# Altium schematic sheet xxxxxx.001_sh1_RTC.SchDoc
size 419 x 297 mm; DocumentNumber: XXXX.467119.XXX Э3; SheetNumber: 1; SheetTotal: 3; Title1str: Плата распределения; Title2str: тактовых частот; PageSetup: Record=PageOptions|CenterHorizontal=False|CenterVertical=False|PrintScale=1.00|XCorrection=0.00|YCorrection=0.00|PrintKind=1|BorderSize=5000000|LeftOffset=0|BottomOffset=0|Orientation=2|PaperLength=1000|PaperWidth=1000|Scale=100|PaperSource=7|PrintQuality=-4|MediaType=1|DitherType=10|PrintScaleMode=0|PaperKind=A3|PaperIndex=8; TypeOfSchem: Схема электрическая принципиальная; DocumentNumberE3: XXXX.467119.XXX Э3; DocumentName: Sheet1.SCHDOC
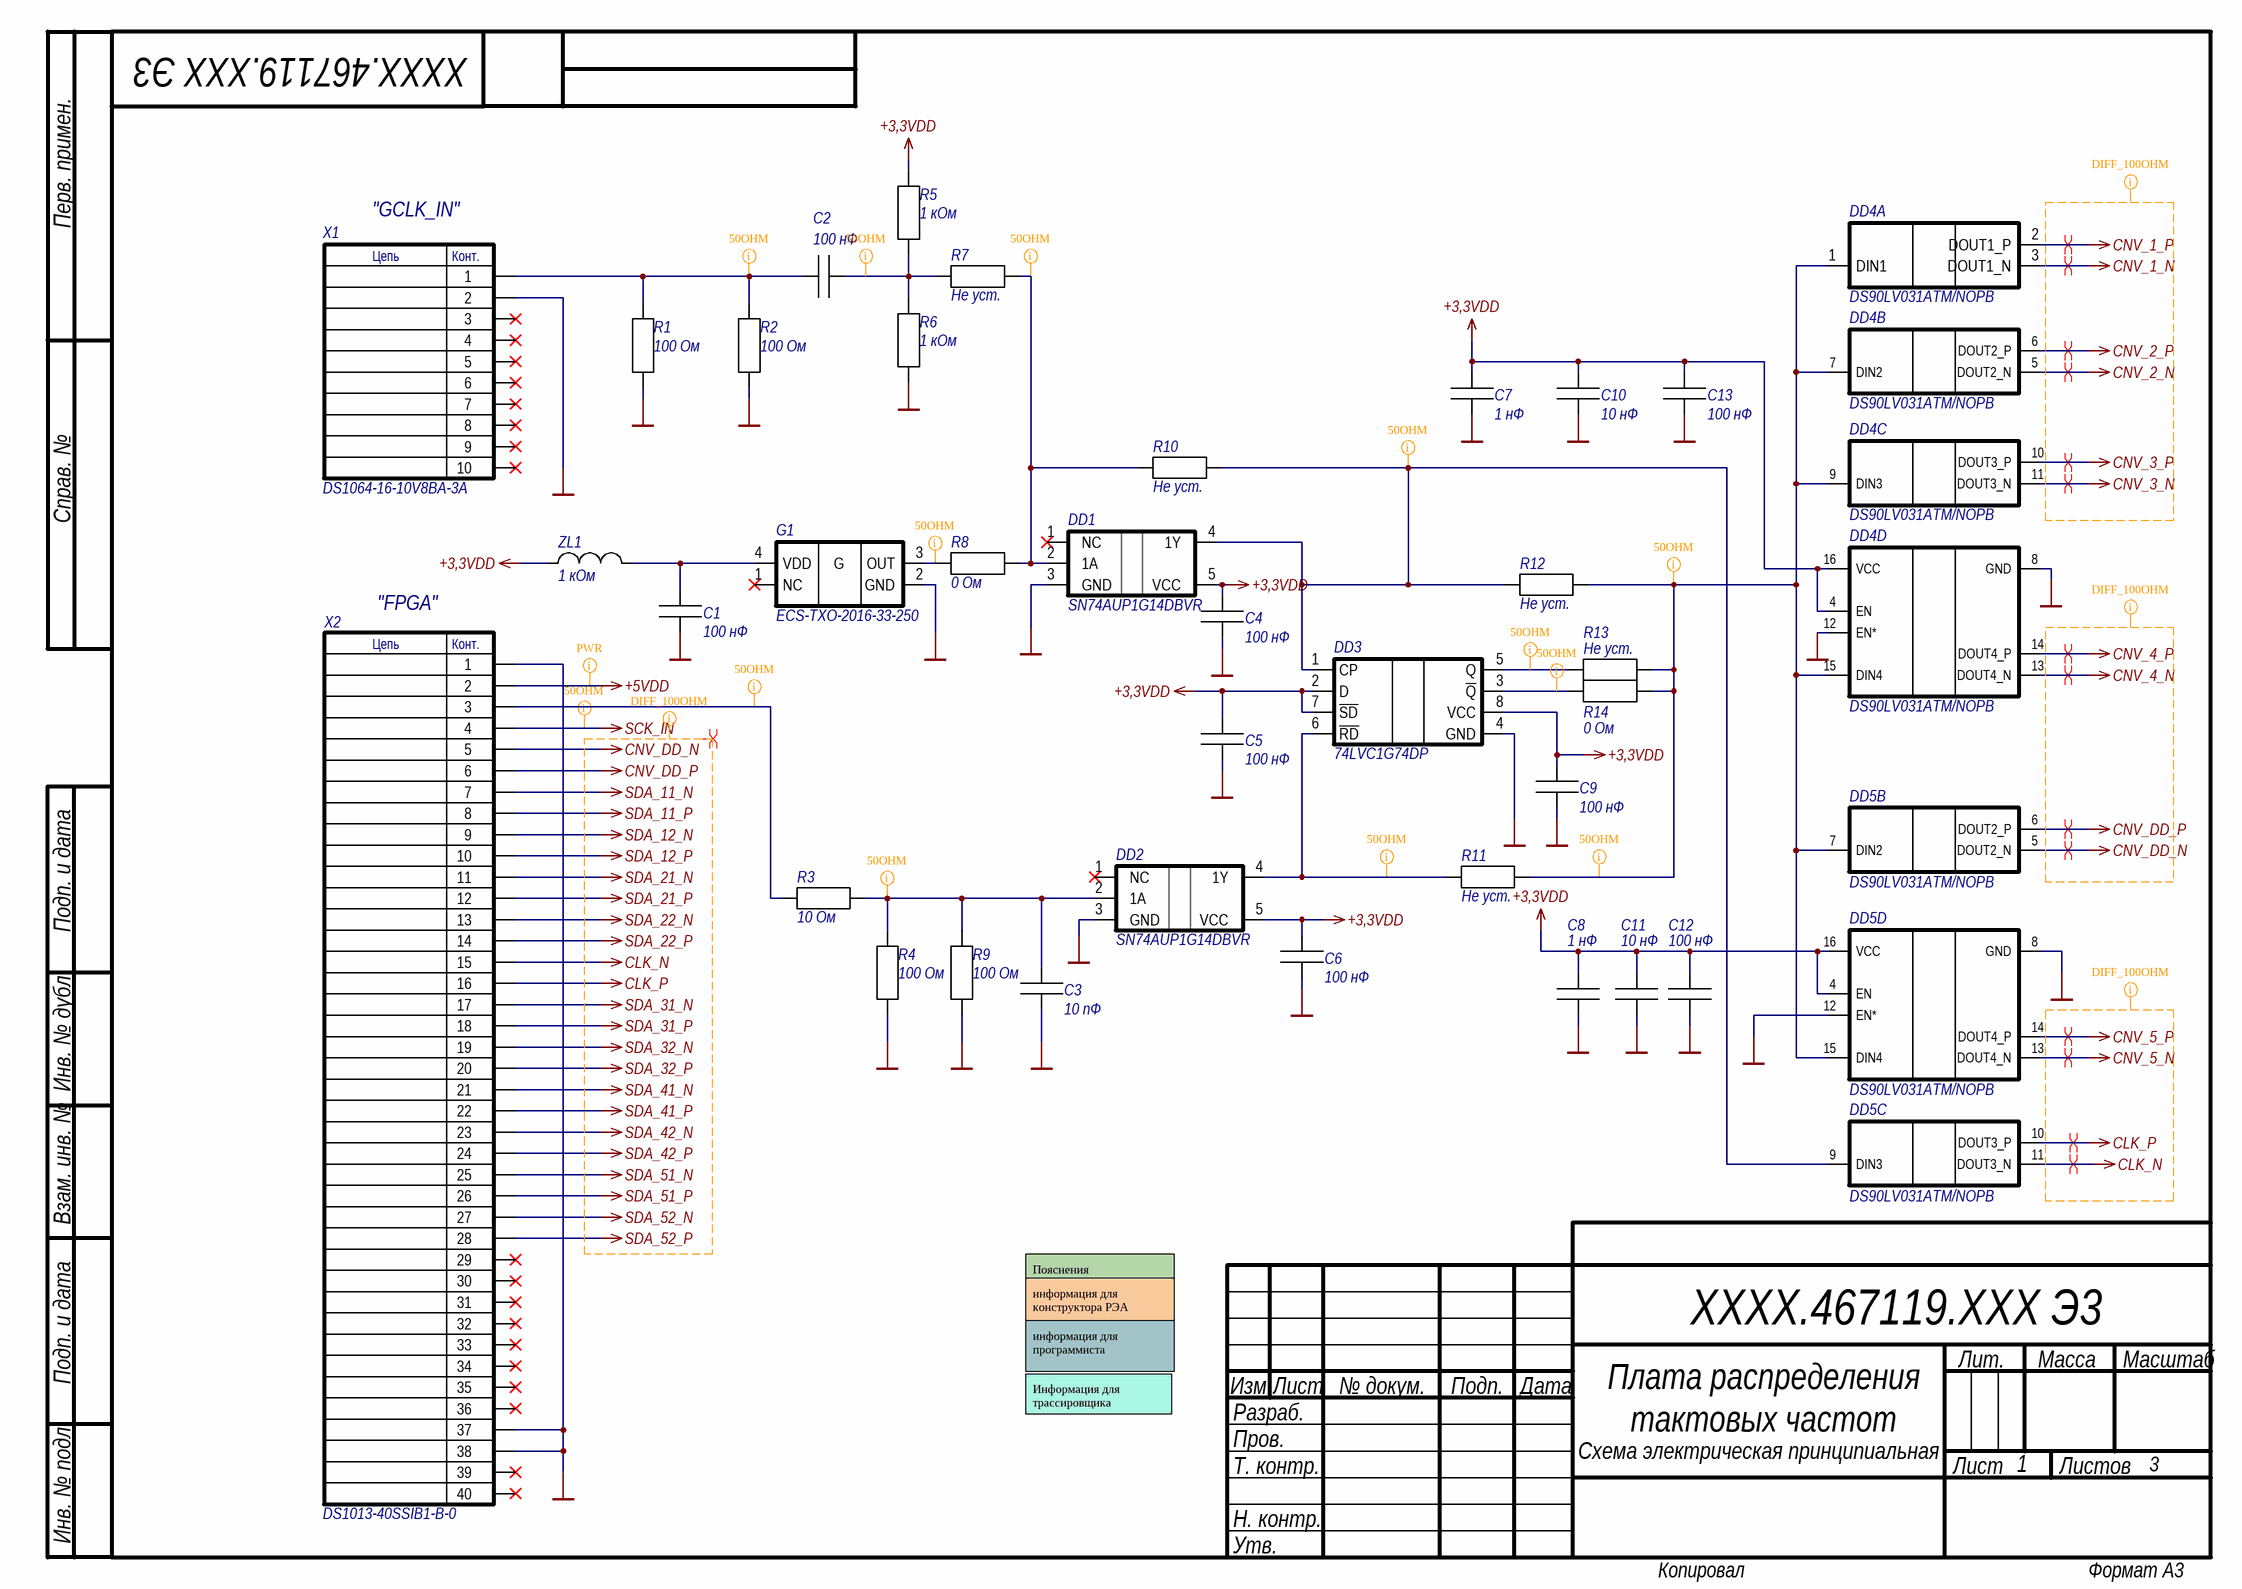
[diagram p0: xxxxxx.001_sh1_RTC.SchDoc]

## Parts
C1  100 нФ  [CAPC160X080X080N]
C2  100 нФ  [CAPC160X080X080N]
C3  10 пФ  [CAPC160X080X080N]
C4  100 нФ  [CAPC160X080X080N]
C5  100 нФ  [CAPC160X080X080N]
C6  100 нФ  [CAPC160X080X080N]
C7  1 нФ  [CAPC160X080X080N]
C8  1 нФ  [CAPC160X080X080N]
C9  100 нФ  [CAPC160X080X080N]
C10  10 нФ  [CAPC160X080X080N]
C11  10 нФ  [CAPC160X080X080N]
C12  100 нФ  [CAPC160X080X080N]
C13  100 нФ  [CAPC160X080X080N]
DD1  SN74AUP1G14DBVR  [TI_DBV0005A_SOT23_5]
DD2  SN74AUP1G14DBVR  [TI_DBV0005A_SOT23_5]
DD3  74LVC1G74DP  [TSOP65P400X110-8N]
DD4  DS90LV031ATM/NOPB  [SOIC127P600X175-16N]  (parts A,B,C,D of 4)
DD5  DS90LV031ATM/NOPB  [SOIC127P600X175-16N]  (parts B,C,D of 4)
G1  ECS-TXO-2016-33-250  [OSCCC160X200X80-4N]
R1  100 Ом  [RESC160X080X045N]
R2  100 Ом  [RESC160X080X045N]
R3  10 Ом  [RESC160X080X045N]
R4  100 Ом  [RESC160X080X045N]
R5  1 кОм  [RESC160X080X045N]
R6  1 кОм  [RESC160X080X045N]
R7  Не уст.  [RESC160X080X045N]
R8  0 Ом  [RESC160X080X045N]
R9  100 Ом  [RESC160X080X045N]
R10  Не уст.  [RESC160X080X045N]
R11  Не уст.  [RESC160X080X045N]
R12  Не уст.  [RESC160X080X045N]
R13  Не уст.  [RESC160X080X045N]
R14  0 Ом  [RESC160X080X045N]
X1  DS1064-16-10V8BA-3A  [BHTH127x254_2X5]
X2  DS1013-40SSIB1-B-0  [BHTH254_2X20]
ZL1  1 кОм  [INDC100X050X050N]

## Nets
+3,3VDD: C4.1 C5.1 C6.1 C7.1 C8.1 C9.1 C10.1 C11.1 C12.1 C13.1 DD1.5(VCC) DD2.5(VCC) DD3.2(D) DD3.7(~{SD}) DD3.8(VCC) DD4.4(EN) DD4.16(VCC) DD5.4(EN) DD5.16(VCC) R5.1 ZL1.1
+5VDD: X2.2
CLK_N: DD5.11(DOUT3_N) X2.15
CLK_P: DD5.10(DOUT3_P) X2.16
CNV_1_N: DD4.3(DOUT1_N)
CNV_1_P: DD4.2(DOUT1_P)
CNV_2_N: DD4.5(DOUT2_N)
CNV_2_P: DD4.6(DOUT2_P)
CNV_3_N: DD4.11(DOUT3_N)
CNV_3_P: DD4.10(DOUT3_P)
CNV_4_N: DD4.13(DOUT4_N)
CNV_4_P: DD4.14(DOUT4_P)
CNV_5_N: DD5.13(DOUT4_N)
CNV_5_P: DD5.14(DOUT4_P)
CNV_DD_N: DD5.5(DOUT2_N) X2.5
CNV_DD_P: DD5.6(DOUT2_P) X2.6
GND: C1.2 C3.2 C4.2 C5.2 C6.2 C7.2 C8.2 C9.2 C10.2 C11.2 C12.2 C13.2 DD1.3(GND) DD2.3(GND) DD3.4(GND) DD4.8(GND) DD4.12(EN*) DD5.8(GND) DD5.12(EN*) G1.2(GND) R1.2 R2.2 R4.2 R6.2 R9.2 X1.2 X2.1 X2.37 X2.38
SCK_IN: X2.4
SDA_11_N: X2.7
SDA_11_P: X2.8
SDA_12_N: X2.9
SDA_12_P: X2.10
SDA_21_N: X2.11
SDA_21_P: X2.12
SDA_22_N: X2.13
SDA_22_P: X2.14
SDA_31_N: X2.17
SDA_31_P: X2.18
SDA_32_N: X2.19
SDA_32_P: X2.20
SDA_41_N: X2.21
SDA_41_P: X2.22
SDA_42_N: X2.23
SDA_42_P: X2.24
SDA_51_N: X2.25
SDA_51_P: X2.26
SDA_52_N: X2.27
SDA_52_P: X2.28
NetC1_1: C1.1 G1.4(VDD) ZL1.2
NetC2_1: C2.1 R1.1 R2.1 X1.1
NetC2_2: C2.2 R5.2 R6.1 R7.1
NetC3_1: C3.1 DD2.2(1A) R3.2 R4.1 R9.1
NetDD1_2: DD1.2(1A) R7.2 R8.2 R10.1
NetDD1_4: DD1.4(1Y) DD3.1(CP) DD5.9(DIN3) R10.2 R12.1
NetDD2_4: DD2.4(1Y) DD3.6(~{RD}) R11.1
NetDD3_3: DD3.3(~{Q}) R14.1
NetDD3_5: DD3.5(Q) R13.1
NetDD4_1: DD4.1(DIN1) DD4.7(DIN2) DD4.9(DIN3) DD4.15(DIN4) DD5.7(DIN2) DD5.15(DIN4) R11.2 R12.2 R13.2 R14.2
NetG1_3: G1.3(OUT) R8.1
NetR3_1: R3.1 X2.3

Not connected (* = marked no-connect by the designer): DD1 1(NC)*; DD2 1(NC)*; G1 1(NC)*; X1 3* 4* 5* 6* 7* 8* 9* 10*; X2 29* 30* 31* 32* 33* 34* 35* 36* 39* 40*

## Layout directives
differential pair: CLK_N, CLK_P, CNV_1_N, CNV_1_P, CNV_2_N, CNV_2_P, CNV_3_N, CNV_3_P, CNV_4_N, CNV_4_P, CNV_5_N, CNV_5_P, CNV_DD_N, CNV_DD_P, SDA_11_N, SDA_11_P, SDA_12_N, SDA_12_P, SDA_21_N, SDA_21_P, SDA_22_N, SDA_22_P, SDA_31_N, SDA_31_P, SDA_32_N, SDA_32_P, SDA_41_N, SDA_41_P, SDA_42_N, SDA_42_P, SDA_51_N, SDA_51_P, SDA_52_N, SDA_52_P
net class DIFF_100OHM: CLK_N, CLK_P, CNV_1_N, CNV_1_P, CNV_2_N, CNV_2_P, CNV_3_N, CNV_3_P, CNV_4_N, CNV_4_P, CNV_5_N, CNV_5_P, CNV_DD_N, CNV_DD_P, SDA_11_N, SDA_11_P, SDA_12_N, SDA_12_P, SDA_21_N, SDA_21_P, SDA_22_N, SDA_22_P, SDA_31_N, SDA_31_P, SDA_32_N, SDA_32_P, SDA_41_N, SDA_41_P, SDA_42_N, SDA_42_P, SDA_51_N, SDA_51_P, SDA_52_N, SDA_52_P
net class 50OHM: NetC2_1, NetC2_2, NetC3_1, NetDD1_2, NetDD1_4, NetDD2_4, NetDD3_3, NetDD3_5, NetDD4_1, NetG1_3, NetR3_1, SCK_IN
net class PWR: +5VDD

## Notes on the sheet
- "GCLK_IN"
- "FPGA"
- Пояснения
- информация для конструктора РЭА
- информация для программиста
- Информация для трассировщика
- Перв. примен.
- Справ. №
- Подп. и дата
- Инв. № дубл.
- Взам. инв. №
- Лит.
- Масса
- Масштаб
- Изм.
- Разраб.
- Лист
- № докум.
- Подп.
- Дата
- Т. контр.
- Пров.
- Листов
- Инв. № подл.
- Утв.
- Н. контр.
- Копировал
- Формат A3
- (in symbol 16896) Цепь; Конт.
- (in symbol 16897) Цепь; Конт.
- (in symbol 16902) G

## Library data of the parts
C1 C2 C4-C6 C9 C12 C13 = 16734: Chip Monolithic Ceramic Capacitor; Manufacturer: Murata; Part Number: GRM188R71E104KA01D; Number: 16734; Type: Конденсатор; Ceramic Type: X7R; Voltage: 25 В; Tolerance: ±10%; ValueBOM: Chip Monolithic Ceramic Capacitor, 0603, X7R, 25V, ±10%, 100n; Package: 0603; Series: GRM188; ValueSCH: 100 нФ; ComponentLink1Description: Datasheet; ComponentLink1URL: ftp://51.15.50.217/murata/capacitors/chip_monolithic_ceramic_cap.pdf; Note: *; ManufacturerPartNumber: GRM188R71E104KA01D
C3 = 274: Multilayer Ceramic Chip Capacitor; Manufacturer: Yageo; Part Number: CC0603GPNP09BN100; Number: 274; Type: Конденсатор; Ceramic Type: NP0; Voltage: 50 В; Tolerance: ±2%; ValueBOM: Multilayer Ceramic Chip Capacitor, 0603, NP0, 50V, ±2%, 10p; Package: 0603; Series: CC0603; ValueSCH: 10 пФ; HelpURL: http://www.yageo.com/e; ComponentLink1Description: Datasheet; ComponentLink1URL: ftp://51.15.50.217/yageo/capasitors/CC_series_(NP0).pdf#; Modify Date: 25.03.2009; Note: *; ManufacturerPartNumber: CC0603GPNP09BN100
C7 C8 = 16711: Chip Monolithic Ceramic Capacitor; Manufacturer: Murata; Part Number: GRM188R71H102KA01D; Number: 16711; Type: Конденсатор; Ceramic Type: X7R; Voltage: 50 В; Tolerance: ±10%; ValueBOM: Chip Monolithic Ceramic Capacitor, 0603, X7R, 50V, ±10%, 1n; Package: 0603; Series: GRM188; ValueSCH: 1 нФ; ComponentLink1Description: Datasheet; ComponentLink1URL: ftp://51.15.50.217/murata/capacitors/chip_monolithic_ceramic_cap.pdf; Note: *; ManufacturerPartNumber: GRM188R71H102KA01D
C10 C11 = 16728: Chip Monolithic Ceramic Capacitor; Manufacturer: Murata; Part Number: GRM188R71E103KA01D; Number: 16728; Type: Конденсатор; Ceramic Type: X7R; Voltage: 25 В; Tolerance: ±10%; ValueBOM: Chip Monolithic Ceramic Capacitor, 0603, X7R, 25V, ±10%, 10n; Package: 0603; Series: GRM188; ValueSCH: 10 нФ; ComponentLink1Description: Datasheet; ComponentLink1URL: ftp://51.15.50.217/murata/capacitors/chip_monolithic_ceramic_cap.pdf; Note: *; ManufacturerPartNumber: GRM188R71E103KA01D
DD1 DD2 = 16900: Low-Power Single Schmitt-Trigger Inverter; Manufacturer: Texas Instruments; Number: 16900; Type: Микросхема цифровая; Part Number: SN74AUP1G14DBVR; ValueSCH: SN74AUP1G14DBVR; ValueBOM: Low-Power Single Schmitt-Trigger Inverter; Modify Date: 21.06.2023; Mount: 1; Package: 101; Note: *; ManufacturerPartNumber: SN74AUP1G14DBVR
DD3 = 16899: Single D-type flip-flop with set and reset; Manufacturer: Nexperia; Number: 16899; Type: Микросхема цифровая; Part Number: 74LVC1G74DP; ValueSCH: 74LVC1G74DP; ValueBOM: Single D-type flip-flop with set and reset; Modify Date: 21.06.2023; Mount: 1; Package: 135; Note: *; ManufacturerPartNumber: 74LVC1G74DP
DD4 DD5 = 16898: 3-V LVDS Quad CMOS Differential Line Driver; Manufacturer: Texas Instruments; Number: 16898; Type: Микросхема цифровая; Part Number: DS90LV031ATM/NOPB; ValueSCH: DS90LV031ATM/NOPB; ValueBOM: 3-V LVDS Quad CMOS Differential Line Driver; Modify Date: 21.06.2023; Note: *; ManufacturerPartNumber: DS90LV031ATM/NOPB
G1 = 16902: SMD CMOS TCXO, 25 МГц, ±2.5ppm; Manufacturer: ECS INC INTERNATIONAL; Number: 16902; ValueSCH: 25 МГц; Type: Генератор; Package: 68; Series: TXO-2016; Part Number: ECS-TXO-2016-33-250; ValueBOM: SMD CMOS TCXO, 25 МГц, ±2.5ppm; Modify Date: 21.06.2023; Mount: 1; Note1SCH: 25 МГц; Note2SCH: ±2.5ppm; Note: *; ManufacturerPartNumber: ECS-TXO-2016-33-250
R1 R2 R4 R9 = 2702: General Purpose Chip Resistor; Manufacturer: Yageo; Part Number: RC0603FR-13100R; Number: 2702; Power: 100 мВт; Tolerance: ±1%; ValueBOM: General Purpose Chip Resistor, 0603, ±1%, 100R; Type: Резистор; Package: 0603; Series: RC0603; ValueSCH: 100 Ом; HelpURL: http://www.yageo.com/e; ComponentLink1Description: Datasheet; ComponentLink1URL: ftp://51.15.50.217/yageo/resistors/RC0603_series.pdf#; Modify Date: 04.01.2009; Note: *; ManufacturerPartNumber: RC0603FR-13100R
R3 = 2588: General Purpose Chip Resistor; Manufacturer: Yageo; Part Number: RC0603FR-1310R; Number: 2588; Power: 100 мВт; Tolerance: ±1%; ValueBOM: General Purpose Chip Resistor, 0603, ±1%, 10R; Type: Резистор; Package: 0603; Series: RC0603; ValueSCH: 10 Ом; HelpURL: http://www.yageo.com/e; ComponentLink1Description: Datasheet; ComponentLink1URL: ftp://51.15.50.217/yageo/resistors/RC0603_series.pdf#; Modify Date: 04.01.2009; Note: *; ManufacturerPartNumber: RC0603FR-1310R
R5 R6 = 2816: General Purpose Chip Resistor; Manufacturer: Yageo; Part Number: RC0603FR-131K; Number: 2816; Power: 100 мВт; Tolerance: ±1%; ValueBOM: General Purpose Chip Resistor, 0603, ±1%, 1K; Type: Резистор; Package: 0603; Series: RC0603; ValueSCH: 1 кОм; HelpURL: http://www.yageo.com/e; ComponentLink1Description: Datasheet; ComponentLink1URL: ftp://51.15.50.217/yageo/resistors/RC0603_series.pdf#; Modify Date: 04.01.2009; Note: *; ManufacturerPartNumber: RC0603FR-131K
R7 R10-R13 = 2058: General Purpose Chip Resistor; Manufacturer: Yageo; Part Number: RC0603JR-130R; Number: 2058; Power: 100 мВт; Tolerance: ±5%; ValueSCH: 0 Ом; ValueBOM: General Purpose Chip Resistor, 0603, ±5%, 0R; Type: Резистор; Package: 0603; Series: RC0603; HelpURL: http://www.yageo.com/e; ComponentLink1Description: Datasheet; ComponentLink1URL: ftp://51.15.50.217/yageo/resistors/RC0603_series.pdf#; Modify Date: 04.01.2009; Note: Не уст.; ManufacturerPartNumber: RC0603JR-130R
R8 R14 = 2058: General Purpose Chip Resistor; Manufacturer: Yageo; Part Number: RC0603JR-130R; Number: 2058; Power: 100 мВт; Tolerance: ±5%; ValueBOM: General Purpose Chip Resistor, 0603, ±5%, 0R; Type: Резистор; Package: 0603; Series: RC0603; ValueSCH: 0 Ом; HelpURL: http://www.yageo.com/e; ComponentLink1Description: Datasheet; ComponentLink1URL: ftp://51.15.50.217/yageo/resistors/RC0603_series.pdf#; Modify Date: 04.01.2009; Note: *; ManufacturerPartNumber: RC0603JR-130R
X1 = 16896: 1.27mm Box Header V/T Type H=7.1mm, 10 pin; Manufacturer: Connfly; Number: 16896; Type: Разъем; Series: DS1023-40; Part Number: DS1064-16-10V8BA-3A; ValueSCH: DS1064-16-10V8BA-3A; ValueBOM: 1.27mm Box Header V/T Type H=7.1mm, 10 pin; Modify Date: 21.06.2023; Note: *; ManufacturerPartNumber: DS1064-16-10V8BA-3A
X2 = 16897: 2.54mm Box Header, Two Rows, 40 pins; Manufacturer: Connfly; Number: 16897; ValueBOM: 2.54mm Box Header, Dual Rows, 40 pins; Type: Разъем; Series: DS1013; Part Number: DS1013-40SSIB1-B-0; ValueSCH: DS1013-40SSIB1-B-0; Modify Date: 21.06.2023; Note: *; ManufacturerPartNumber: DS1013-40SSIB1-B-0
ZL1 = 16895: Chip Ferrite Bead; Manufacturer: Murata; Part Number: BLM15AG102SN1D; Number: 16895; Current: 300 мА; Tolerance: ±25%; ValueBOM: Chip Ferrite Bead, 0402, 300мА, ±25%, 0.65 Ом @ 100 MHz; Type: Индуктивность; Package: 0402; Series: BLM15AG; ValueSCH: 1 кОм; HelpURL: http://www.murata.com/; Modify Date: 20.06.2023; Note: *; ManufacturerPartNumber: BLM15AG102SN1D